# Altium schematic sheet Sheet.SchDoc: Smart IoT Wallswitch CORE module
size A4; Author: Bc. Miroslav Kažimír; DrawnBy: Bc. Miroslav Kažimír; DocumentNumber: Wallswitch Core Module; SheetNumber: 1; SheetTotal: 2
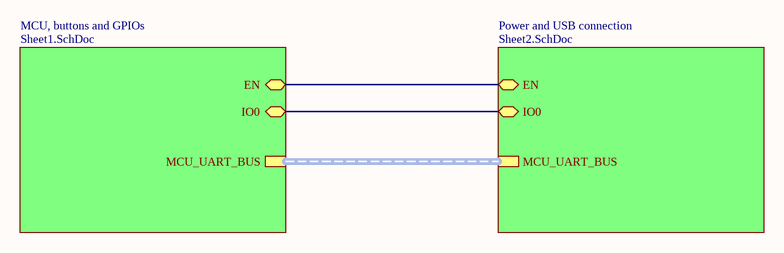
[diagram p0: Sheet.SchDoc]

## Sub-sheets
MCU, buttons and GPIOs = Sheet1.SchDoc: EN (bidir), IO0 (bidir), MCU_UART_BUS (harness MCU_UART_BUS)
Power and USB connection = Sheet2.SchDoc: MCU_UART_BUS (harness MCU_UART_BUS), EN (bidir), IO0 (bidir)

## Nets
(unnamed): sheet MCU, buttons and GPIOs/EN, sheet Power and USB connection/EN
(unnamed): sheet MCU, buttons and GPIOs/IO0, sheet Power and USB connection/IO0

## Buses and harness runs
harness sheet MCU, buttons and GPIOs/MCU_UART_BUS = sheet Power and USB connection/MCU_UART_BUS